# Altium schematic sheet HS100B.SchDoc
size A4
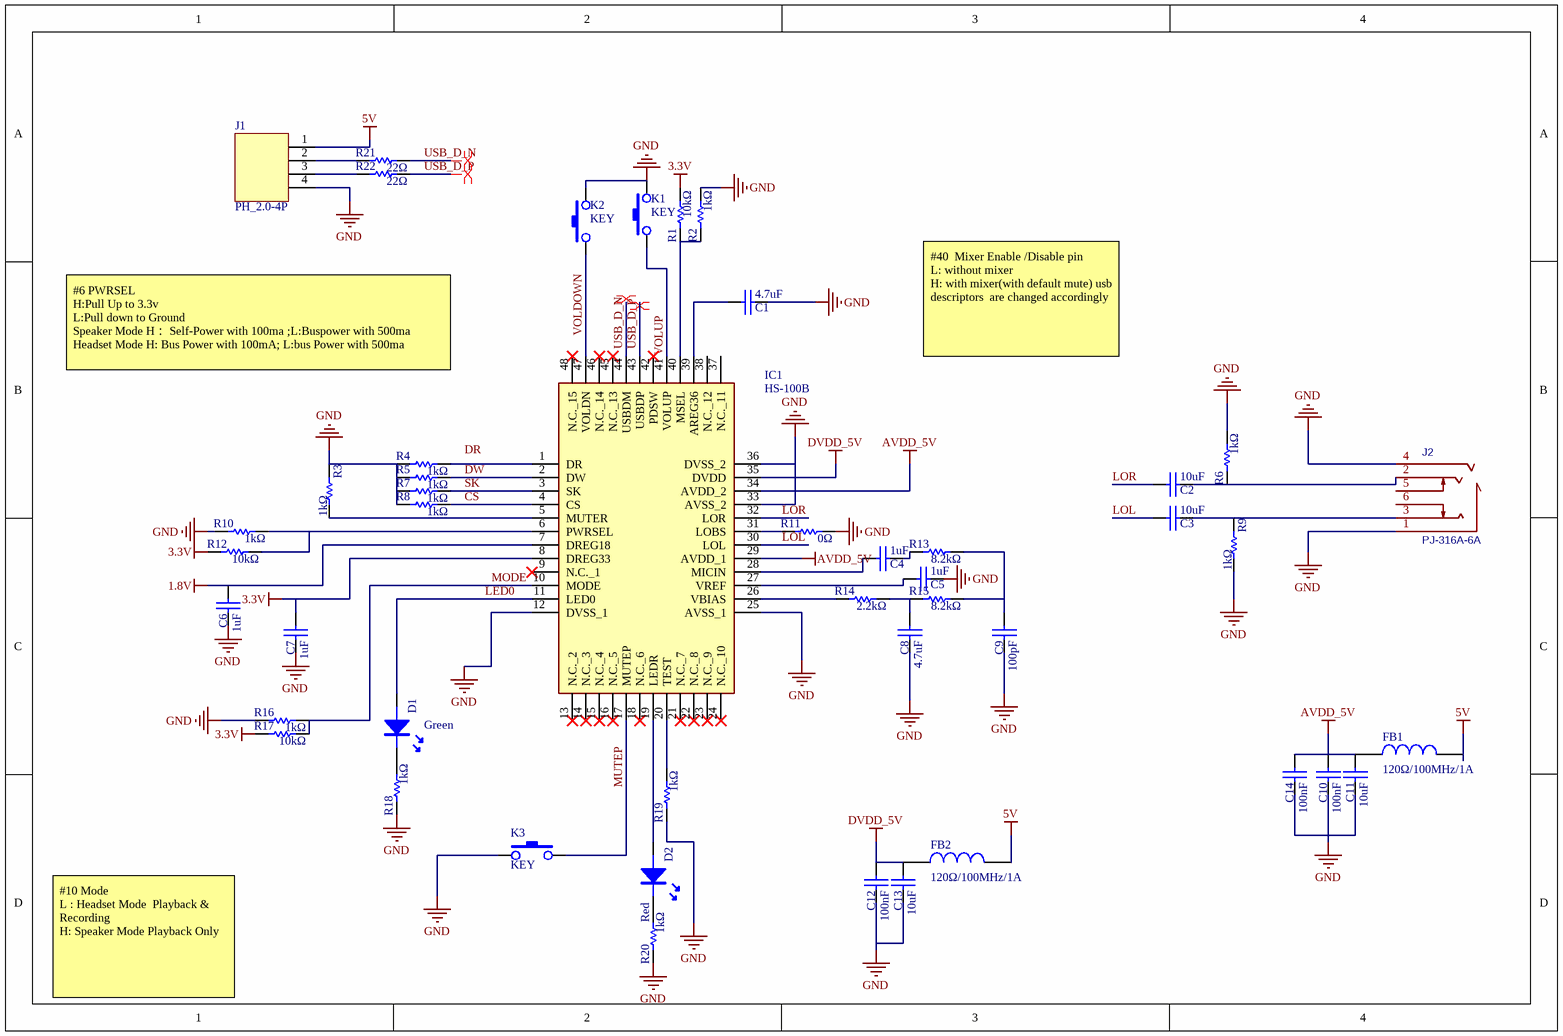
[diagram p0: HS100B.SchDoc]

## Parts
C1  4.7uF  [C_0603]
C2  10uF  [C_0402]
C3  10uF  [C_0402]
C4  1uF  [C_0402]
C5  1uF  [C_0402]
C6  1uF  [C_0402]
C7  1uF  [C_0402]
C8  4.7uF  [C_0402]
C9  100pF  [C_0402]
C10  100nF  [C_0402]
C11  10uF  [C_0603]
C12  100nF  [C_0402]
C13  10uF  [C_0603]
C14  100nF  [C_0402]
D1  Green  [LED-0603-G]
D2  Red  [LED-0603-R]
FB1  120Ω/100MHz/1A  [FB_0603]
FB2  120Ω/100MHz/1A  [FB_0603]
IC1  HS-100B  [QFP50P900X900X160-48N]
J1  PH_2.0-4P  [PH2.0-4P]
J2  PJ-316A-6A  [PJ-316A-6A]
K1  KEY  [SMD-6X6X5]
K2  KEY  [SMD-6X6X5]
K3  KEY  [SMD-6X6X5]
R1  10kΩ  [R_0402]
R2  1kΩ  [R_0402]
R3  1kΩ  [R_0402]
R4  1kΩ  [R_0402]
R5  1kΩ  [R_0402]
R6  1kΩ  [R_0402]
R7  1kΩ  [R_0402]
R8  1kΩ  [R_0402]
R9  1kΩ  [R_0402]
R10  1kΩ  [R_0402]
R11  0Ω  [R_0402]
R12  10kΩ  [R_0402]
R13  8.2kΩ  [R_0402]
R14  2.2kΩ  [R_0402]
R15  8.2kΩ  [R_0402]
R16  1kΩ  [R_0402]
R17  10kΩ  [R_0402]
R18  1kΩ  [R_0402]
R19  1kΩ  [R_0402]
R20  1kΩ  [R_0402]
R21  22Ω  [R_0402]
R22  22Ω  [R_0402]

## Nets
1.8V: C6.1 IC1.7(DREG18)
3.3V: C7.1 IC1.8(DREG33) R1.2 R12.1 R17.1
5V: FB1.2 FB2.2 J1.1
AVDD_5V: C10.1 C11.1 C14.1 FB1.1 IC1.29(AVDD_1) IC1.34(AVDD_2)
DVDD_5V: C12.1 C13.1 FB2.1 IC1.35(DVDD)
GND: C1.2 C5.2 C6.2 C7.2 C8.2 C9.2 C10.2 C11.2 C12.2 C13.2 C14.2 IC1.12(DVSS_1) IC1.25(AVSS_1) IC1.33(AVSS_2) IC1.36(DVSS_2) J1.4 J2.1 J2.4 K1.3 K2.3 K3.1 R2.2 R3.1 R4.1 R5.1 R6.2 R7.1 R8.1 R9.2 R10.1 R11.2 R16.1 R18.1 R19.1 R20.1
CS: IC1.4(CS) R8.2
DW: IC1.2(DW) R5.2
LED0: D1.A IC1.11(LED0)
LOL: C3.1 IC1.30(LOL)
LOR: C2.1 IC1.32(LOR)
MODE: IC1.10(MODE) R16.2 R17.2
MUTEP: IC1.17(MUTEP) K3.3
SK: IC1.3(SK) R7.2
USB_D_N: IC1.44(USBDM) R21.2
USB_D_P: IC1.43(USBDP) R22.2
VOLDOWN: IC1.47(VOLDN) K2.1
VOLUP: IC1.41(VOLUP) K1.1
NetC1_1: C1.1 IC1.39(AREG36)
NetC2_2: C2.2 J2.2 R6.1
NetC3_2: C3.2 J2.3 R9.1
NetC4_1: C4.1 IC1.28(MICIN)
NetC4_2: C4.2 R13.1
NetC5_1: C5.1 IC1.27(VREF)
NetC8_1: C8.1 R14.2 R15.1
NetC9_1: C9.1 R13.2 R15.2
NetD1_K: D1.K R18.2
NetD2_A: D2.A IC1.19(LEDR)
NetD2_K: D2.K R20.2
NetIC1_1: IC1.1(DR) R4.2
NetIC1_5: IC1.5(MUTER) R3.2
NetIC1_6: IC1.6(PWRSEL) R10.2 R12.2
NetIC1_20: IC1.20(TEST) R19.2
NetIC1_26: IC1.26(VBIAS) R14.1
NetIC1_31: IC1.31(LOBS) R11.1
NetIC1_40: IC1.40(MSEL) R1.1 R2.1
NetJ1_2: J1.2 R21.1
NetJ1_3: J1.3 R22.1

Not connected (* = marked no-connect by the designer): IC1 9(N.C._1)* 13(N.C._2)* 14(N.C._3)* 15(N.C._4)* 16(N.C._5)* 18(N.C._6)* 21(N.C._7)* 22(N.C._8)* 23(N.C._9)* 24(N.C._10)* 37(N.C._11) 38(N.C._12) 42(PDSW)* 45(N.C._13)* 46(N.C._14)* 48(N.C._15)*; J2 5 6

## Layout directives
differential pair: USB_D_N, USB_D_P

## Notes on the sheet
- #6 PWRSEL
  H:Pull Up to 3.3v
  L:Pull down to Ground
  Speaker Mode H： Self-Power with 100ma ;L:Buspower with 500ma
  Headset Mode H: Bus Power with 100mA; L:bus Power with 500ma
- #40  Mixer Enable /Disable pin
  L: without mixer
  H: with mixer(with default mute) usb descriptors  are changed accordingly
- #10 Mode
  L : Headset Mode  Playback & Recording
  H: Speaker Mode Playback Only
- Labels drawn without touching a wire or pin: DR

## Library data of the parts
C1-C14 = Cap_Chip: 贴片电容; Manufacturer_Name: *; Manufacturer_Part_Number: *
D1 D2 = LED_Chip: 贴片LED; Manufacturer_Name: *; Manufacturer_Part_Number: *
FB1 FB2 = Filter_FB: 磁珠; Manufacturer_Name: *; Manufacturer_Part_Number: *
IC1 = HS-100B: Integrated Circuit; Manufacturer_Name: cmedia; Datasheet Link: https://datasheet.lcsc.com/szlcsc/1906061502_Cmedia-HS-100B_C371351.pdf; Height: 1.6mm; Manufacturer_Part_Number: HS-100B
J2 = Audio_PJ-316A-6A: 3.5音频链接座子; BOM_Manufacturer: HRO; BOM_Manufacturer Part: PJ-316A-6A
K1-K3 = KEY: 轻触开关
R1-R22 = Res_Chip: 贴片电阻; Manufacturer_Name: *; Manufacturer_Part_Number: *
J1 = PH_2.0-4P: 厂家型号: *; 商品编号: *